# EasyEDA Pro project 25集创赛海云捷讯杯.epro, schematic Schematic4_2
Board Name: 遥控板; Create Date: 2025-04-06; Page Name: P1; Project Name: 25集创赛海云捷讯杯; Schematic Name: Schematic4_2; Update Date: 2025-04-15; Company: 嘉立创EDA; Page Size: A4; Version: V1.0
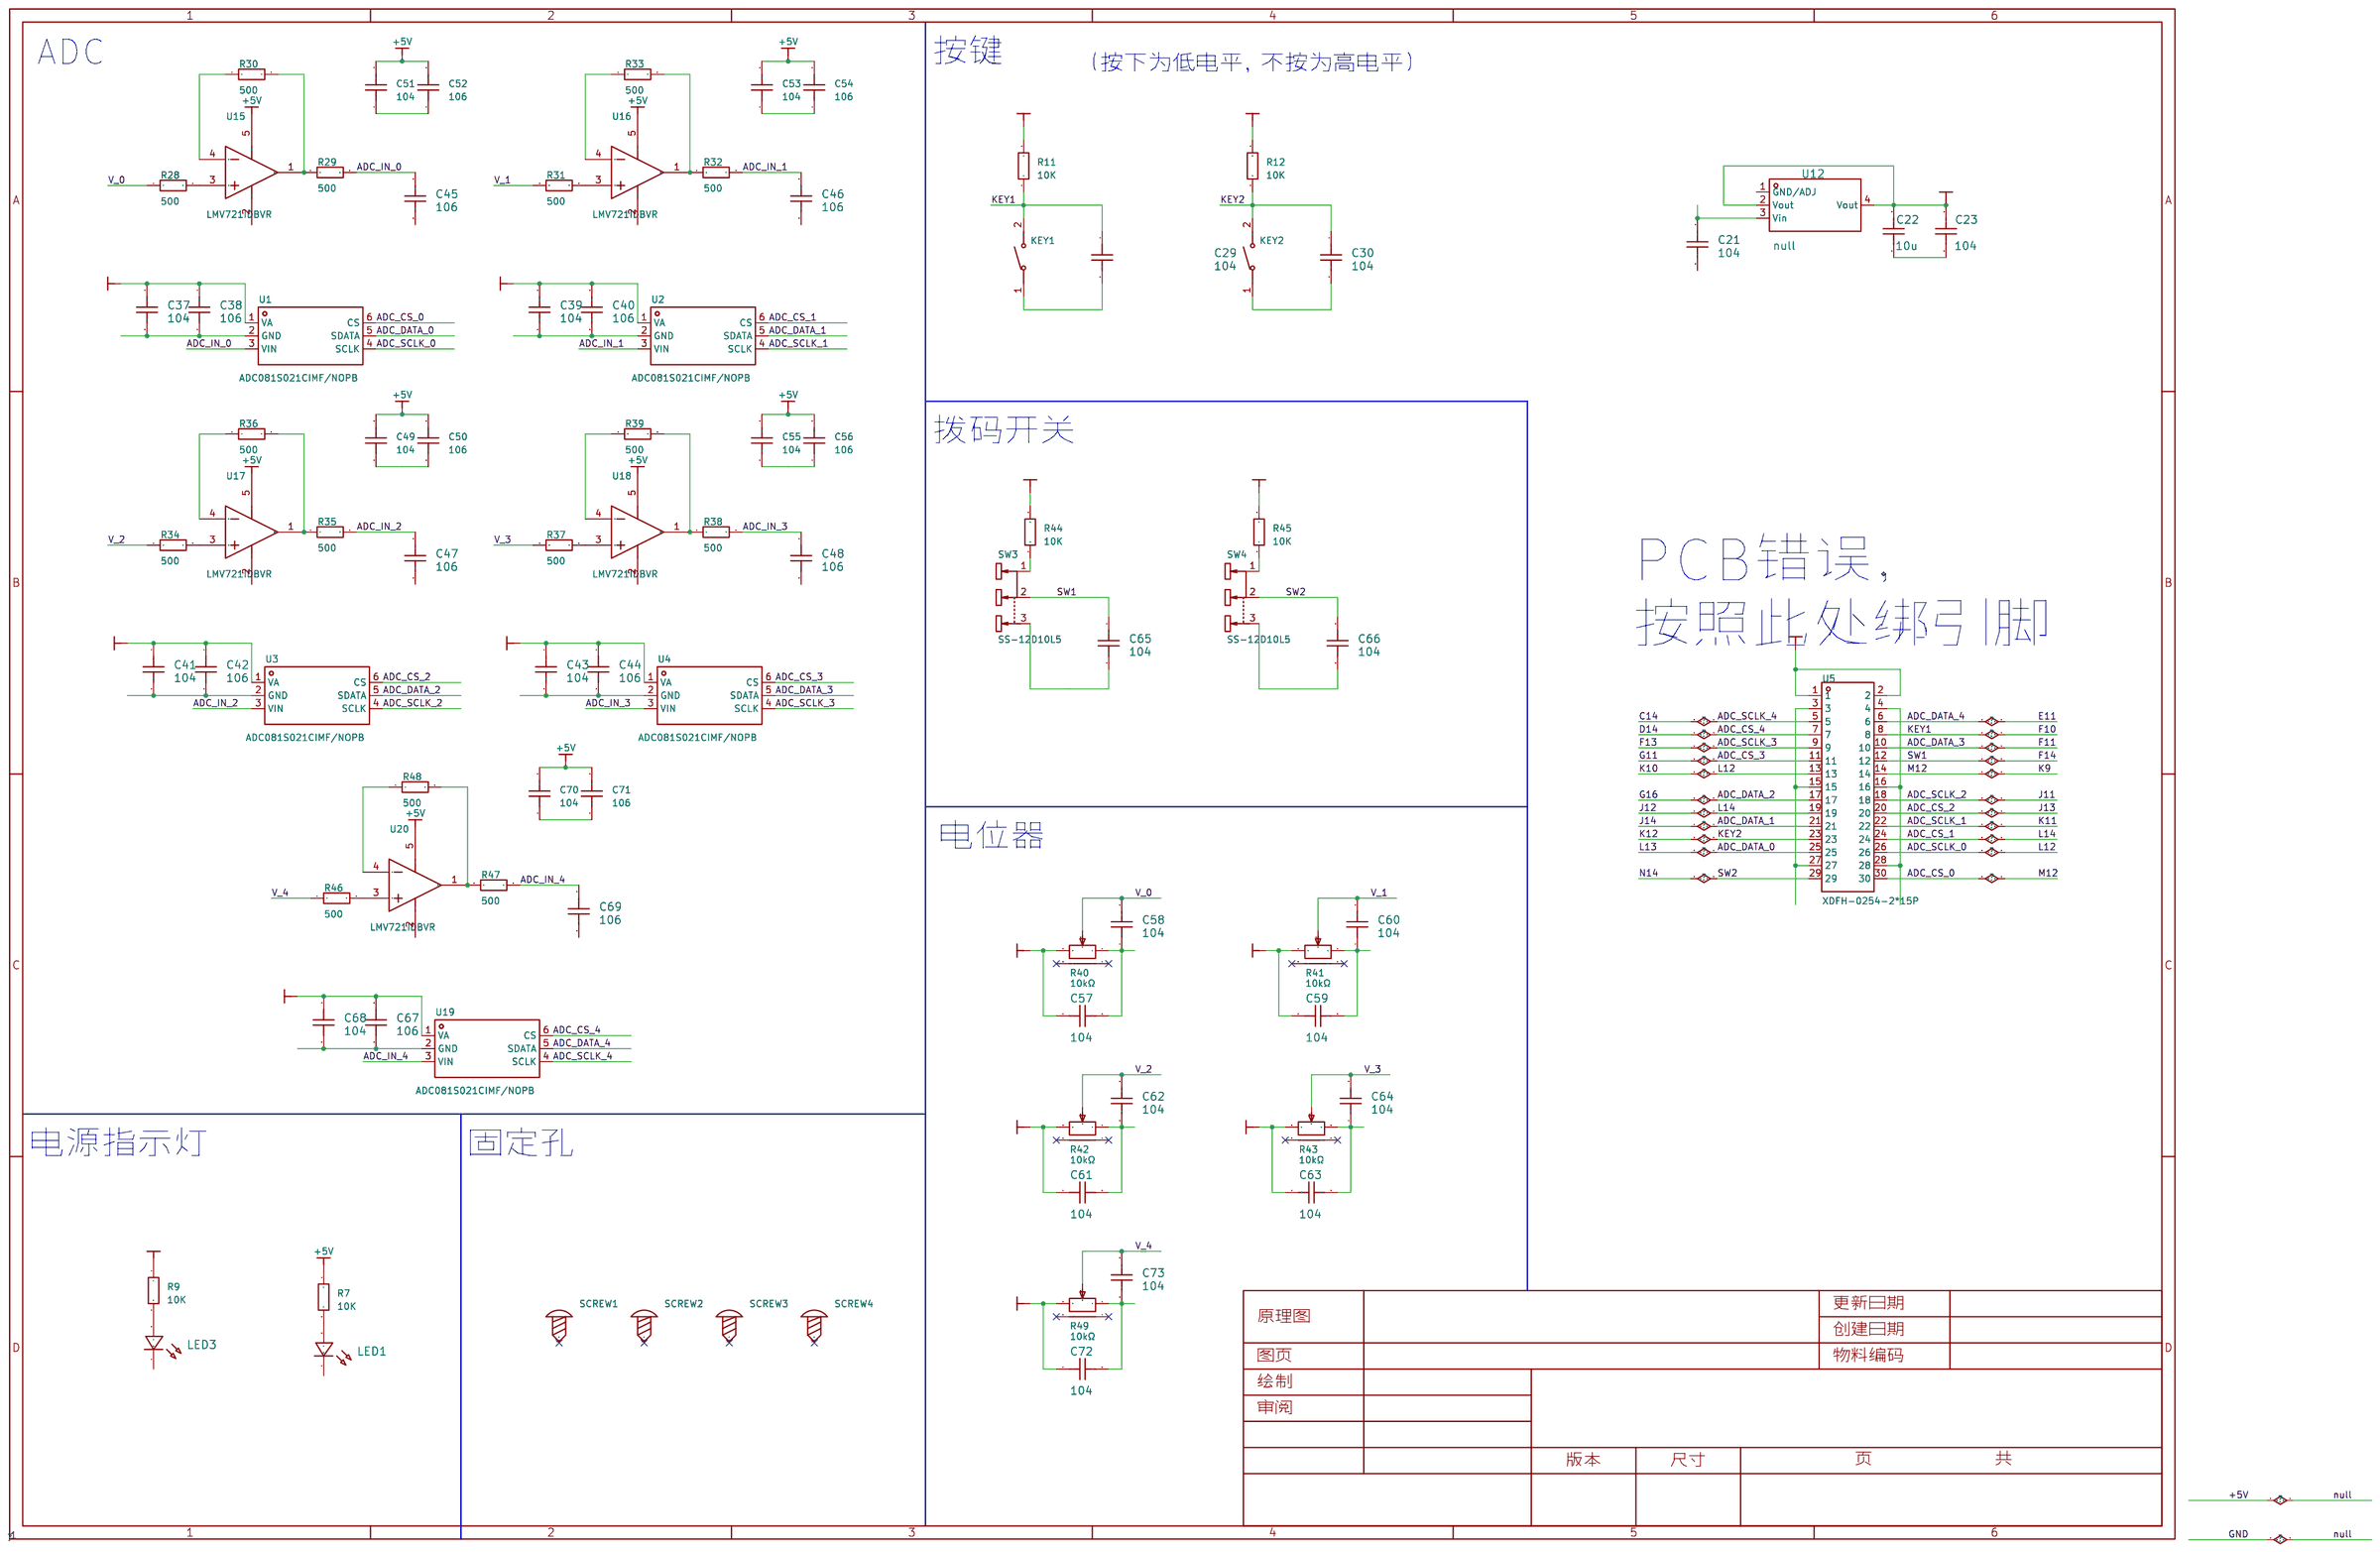
[diagram p5: schematic sheet]

## Parts
C21  104  [c0805]
C22  10u  [c0805]
C23  104  [c0805]
C29  104  [c0805]
C30  104  [c0805]
C37  104  [c0805]
C38  106  [c0805]
C39  104  [c0805]
C40  106  [c0805]
C41  104  [c0805]
C42  106  [c0805]
C43  104  [c0805]
C44  106  [c0805]
C45  106  [c0805]
C46  106  [c0805]
C47  106  [c0805]
C48  106  [c0805]
C49  104  [C0805]
C50  106  [C0805]
C51  104  [C0805]
C52  106  [C0805]
C53  104  [C0805]
C54  106  [C0805]
C55  104  [C0805]
C56  106  [C0805]
C57  104  [c0805]
C58  104  [c0805]
C59  104  [c0805]
C60  104  [c0805]
C61  104  [c0805]
C62  104  [c0805]
C63  104  [c0805]
C64  104  [c0805]
C65  104  [c0805]
C66  104  [c0805]
C67  106  [c0805]
C68  104  [c0805]
C69  106  [c0805]
C70  104  [C0805]
C71  106  [C0805]
C72  104  [c0805]
C73  104  [c0805]
KEY1  TS665WS 250gf  [SW-SMD_L6.0-W6.0-LS6.6]
KEY2  TS665WS 250gf  [SW-SMD_L6.0-W6.0-LS6.6]
LED1  -  [LED_0805]
LED3  -  [LED_0805]
R7  10K  [R0805]
R9  10K  [R0805]
R11  10K  [R0805]
R12  10K  [R0805]
R28  500  [R0805]
R29  500  [R0805]
R30  500  [R0805]
R31  500  [R0805]
R32  500  [R0805]
R33  500  [R0805]
R34  500  [R0805]
R35  500  [R0805]
R36  500  [R0805]
R37  500  [R0805]
R38  500  [R0805]
R39  500  [R0805]
R40  10kΩ  [RES-ADJ-TH_RK09K1130AJ3]
R41  10kΩ  [RES-ADJ-TH_RK09K1130AJ3]
R42  10kΩ  [RES-ADJ-TH_RK09K1130AJ3]
R43  10kΩ  [RES-ADJ-TH_RK09K1130AJ3]
R44  10K  [R0805]
R45  10K  [R0805]
R46  500  [R0805]
R47  500  [R0805]
R48  500  [R0805]
R49  10kΩ  [RES-ADJ-TH_RK09K1130AJ3]
SCREW1  -  [M3螺丝]
SCREW2  -  [M3螺丝]
SCREW3  -  [M3螺丝]
SCREW4  -  [M3螺丝]
SW3  SS-12D10L5  [SW-TH_SS-12D10L5]
SW4  SS-12D10L5  [SW-TH_SS-12D10L5]
U1  ADC081S021CIMF/NOPB  [SOT-23-6_L2.9-W1.6-P0.95-LS2.8-BR]
U2  ADC081S021CIMF/NOPB  [SOT-23-6_L2.9-W1.6-P0.95-LS2.8-BR]
U3  ADC081S021CIMF/NOPB  [SOT-23-6_L2.9-W1.6-P0.95-LS2.8-BR]
U4  ADC081S021CIMF/NOPB  [SOT-23-6_L2.9-W1.6-P0.95-LS2.8-BR]
U5  XDFH-0254-2*15P  [CONN-TH_30P-P2.54_LX_XDFH-0254-2X15P]
U12  null  [ams1117]
U15  LMV721IDBVR  [SOT-23-5_L3.0-W1.7-P0.95-LS2.8-BR]
U16  LMV721IDBVR  [SOT-23-5_L3.0-W1.7-P0.95-LS2.8-BR]
U17  LMV721IDBVR  [SOT-23-5_L3.0-W1.7-P0.95-LS2.8-BR]
U18  LMV721IDBVR  [SOT-23-5_L3.0-W1.7-P0.95-LS2.8-BR]
U19  ADC081S021CIMF/NOPB  [SOT-23-6_L2.9-W1.6-P0.95-LS2.8-BR]
U20  LMV721IDBVR  [SOT-23-5_L3.0-W1.7-P0.95-LS2.8-BR]

## Library data of the parts
C21 C23 C29 C30 C37-C48 C57-C69 C72 C73 = 4.7u
C22 = 1u
C49-C56 C70 C71 = CAP_0805: Supplier Footprint: 0805
KEY1 KEY2 = TS665WS 250gf: 电路结构:单刀单掷;按钮形状:圆形按钮;开关长度:6mm;开关宽度:6mm;开关高度:5mm;带支架:不带;触点电流:50mA;额定电压(DC):12V;额定功率:0.6W;安装方式:立贴;绝缘电阻:100MΩ;带灯:无;作用力:250gf;机械寿命:10万次;; LCSC Part Name: 无声按键开关 6*6*5mm 250G; Supplier Part: C6798384; Manufacturer: SHOU HAN(首韩); Supplier Footprint: SMD; JLCPCB Part Class: Extended Part; Datasheet: https://atta.szlcsc.com/upload/public/pdf/source/20230621/9BA9DAAFF61506696103CF7691F2BF59.pdf; Supplier: LCSC; Circuit: 单刀单掷; Actuator Style: 圆形按钮; Switch Length: 6mm; Switch Width: 6mm; Switch Height: 5mm; Strike Gundam: 不带; Contact Current: 50mA; Voltage Rating (DC): 12V; Power Rating: 0.6W; Mounting Style: 立贴; Insulation Resistance: 100MΩ; Actuator/Cap Color: 黑色; With Lamp: 无; Operating Force: 250gf; Mechanical Life: 10万次; Operating Temperature: -40℃~+80℃
LED1 LED3 = LED_0805-R: Supplier Footprint: 0805
R7 R9 R11 R12 R28-R39 R44-R48 = Res_0805: Supplier Footprint: 0805
R40-R43 R49 = RK09K1130AP5: 阻值:10kΩ;精度:±20%;功率:50mW;; LCSC Part Name: 10kΩ ±20%; Supplier Part: C470295; Manufacturer: ALPSALPINE(阿尔卑斯阿尔派); Supplier Footprint: 插件; JLCPCB Part Class: Extended Part; Datasheet: https://atta.szlcsc.com/upload/public/pdf/source/20191216/C470452_A95F493F84F2A4E5D2456A617FF6269D.pdf; Supplier: LCSC; Tolerance: ±20%; Rated Voltage: 20V; Power(Watts): 50mW
SCREW1-SCREW4 = M3螺丝: Supplier Footprint: 插件
SW3 SW4 = SS-12D10L5: 电路结构:单刀双掷;安装方式:直插;开关颜色:黑色;额定电流(DC):3A;额定电压(DC):125V;额定电流(AC):3A;额定电压(AC):125V;机械寿命:1万次;; LCSC Part Name: 柄长5mm 直插双档 滑动开关; Supplier Part: C319012; Manufacturer: XKB Connectivity(中国星坤); Supplier Footprint: 插件; JLCPCB Part Class: Extended Part; Datasheet: https://atta.szlcsc.com/upload/public/pdf/source/20211009/D6412F37AABE6F9459A6EE7FA4DAEADB.pdf; Supplier: LCSC; Circuit: 单刀双掷; Actuator Style: 矩形柱状; Pin Style: PC引脚; Switch Length: 13mm; Switch Width: 6.8mm; Switch Height: 6.4mm; Mounting Style: 直插; Actuator Color: 黑色; Current Rating (DC): 3A; Voltage Rating (DC): 125V; Current Rating (AC): 3A; Voltage Rating (AC): 125V; Mechanical Life: 1万次; Operating Temperature: -40℃~+85℃
U1-U4 U19 = ADC081S021CIMF/NOPB: 接口:SPI；DSP;电源电压:2.7V~5.25V;采样率:200kHz;分辨率:8位;; Supplier Part: C130227; Manufacturer: TI(德州仪器); Supplier Footprint: SOT-23-6; JLCPCB Part Class: 扩展库; Datasheet: https://www.ti.com/cn/lit/gpn/adc081s021; Supplier: LCSC; Interface: SPI；DSP; number of channels: 1; Supply Voltage: 2.7V~5.25V; sampling frequency: 200kHz; resolution: 8位; Operating Temperature: -40℃~+85℃
U5 = XDFH-0254-2*15P: 连接器类型:简牛座;间距:2.54mm;结构:2x15P;额定电流:3A;额定电压:500V;封装形式:直插;排数:2;每排PIN数:15;触头材质:铜;触头镀层:金;工作温度范围:-45℃~+105℃;焊接温度(最大值):260℃;; LCSC Part Name: 镀2U全金品质简牛插座PH2.54MM-2*15PIN直插板 DIP; Supplier Part: C19193814; Manufacturer: LX(连欣科技); Supplier Footprint: 插件,P=2.54mm; JLCPCB Part Class: 扩展库; Datasheet: https://atta.szlcsc.com/upload/public/pdf/source/20231117/B05B179C28F8598ADEE3EE3DBCADEC41.pdf; Supplier: LCSC; Connector Type: 简牛座; Pitch: 2.54mm; Structure: 2x15P; Current Rating (Max): 3A; Voltage Rating (Max): 500V; Holder Type: 直插; Number of Rows: 2; Pin Number in each Row: 15; Contact Material: 铜; Contact Plating: 金; Operating Temperature Range: -45℃~+105℃; Soldering Temperature(Max): 260℃
U12 = AMS1117-3.3: Supplier: LCSC; Manufacturer: AMS; Supplier Part: C6186; JLCPCB Part Class: BasicPart
U15-U18 U20 = LMV721IDBVR: 放大器数:单路;增益带宽积(GBP):10MHz;输入偏置电流(Ib):260nA;压摆率(SR):5.25V/us;带宽(-3db):-;轨到轨:-;; Supplier Part: C96137; Manufacturer: TI(德州仪器); Supplier Footprint: SOT-23-5; JLCPCB Part Class: 扩展库; Datasheet: https://www.ti.com/cn/lit/gpn/lmv721; Supplier: LCSC; Number of Circuits: 单路; Gain Bandwidth Product(GBP): 10MHz; Current - Input Bias(Ib): 260nA; Slew Rate(SR): 5.25V/us; Operating Temperature: -40℃~+105℃

## Nets
+3.3V: C22.2 C23.2 C37.1 C38.1 C39.1 C40.1 C41.1 C42.1 C43.1 C44.1 C57.1 C59.1 C61.1 C63.1 C67.1 C68.1 C72.1 R9.1 R11.2 R12.2 R40.3 R41.3 R42.3 R43.3 R44.2 R45.2 R49.3 U1.1(VA) U2.1(VA) U3.1(VA) U4.1(VA) U12.2(Vout) U12.4(Vout) U19.1(VA)
+5V: C21.1 C21.2 C22.1 C23.1 C29.2 C30.2 C37.2 C38.2 C39.2 C40.2 C41.2 C42.2 C43.2 C44.2 C45.2 C46.2 C47.2 C48.2 C49.1 C49.2 C50.1 C50.2 C51.1 C51.2 C52.1 C52.2 C53.1 C53.2 C54.1 C54.2 C55.1 C55.2 C56.1 C56.2 C57.2 C58.1 C59.2 C60.1 C61.2 C62.1 C63.2 C64.1 C65.2 C66.2 C67.2 C68.2 C69.2 C70.1 C70.2 C71.1 C71.2 C72.2 C73.1 KEY1.1(A) KEY2.1(A) LED1.1(C) LED3.1(C) R7.1 R40.1 R41.1 R42.1 R43.1 R49.1 SW3.3 SW4.3 U1.2(GND) U2.2(GND) U3.2(GND) U4.2(GND) U5.1 U5.2 U5.3 U5.4 U5.15 U5.16 U5.27 U5.28 U12.1(GND/ADJ) U12.3(Vin) U15.2(VCC-) U15.5(VCC+) U16.2(VCC-) U16.5(VCC+) U17.2(VCC-) U17.5(VCC+) U18.2(VCC-) U18.5(VCC+) U19.2(GND) U20.2(VCC-) U20.5(VCC+)
ADC_CS_0: U1.6(CS) U5.14 U5.30
ADC_CS_1: U2.6(CS) U5.19 U5.24
ADC_CS_2: U3.6(CS) U5.20
ADC_CS_3: U4.6(CS) U5.11
ADC_CS_4: U5.7 U19.6(CS)
ADC_DATA_0: U1.5(SDATA) U5.25
ADC_DATA_1: U2.5(SDATA) U5.21
ADC_DATA_2: U3.5(SDATA) U5.17
ADC_DATA_3: U4.5(SDATA) U5.10
ADC_DATA_4: U5.6 U19.5(SDATA)
ADC_IN_0: C45.1 R29.2 U1.3(VIN)
ADC_IN_1: C46.1 R32.2 U2.3(VIN)
ADC_IN_2: C47.1 R35.2 U3.3(VIN)
ADC_IN_3: C48.1 R38.2 U4.3(VIN)
ADC_IN_4: C69.1 R47.2 U19.3(VIN)
ADC_SCLK_0: U1.4(SCLK) U5.13 U5.26
ADC_SCLK_1: U2.4(SCLK) U5.22
ADC_SCLK_2: U3.4(SCLK) U5.18
ADC_SCLK_3: U4.4(SCLK) U5.9
ADC_SCLK_4: U5.5 U19.4(SCLK)
F10: C29.1 KEY1.2(B) R11.1 U5.8
F14: C65.1 SW3.2 U5.12
K12: C30.1 KEY2.2(B) R12.1 U5.23
N14: C66.1 SW4.2 U5.29
V_0: C58.2 R28.1 R40.2
V_1: C60.2 R31.1 R41.2
V_2: C62.2 R34.1 R42.2
V_3: C64.2 R37.1 R43.2
V_4: C73.2 R46.1 R49.2
$1N940: LED3.2(A) R9.2
$1N1188: R28.2 U15.3(IN+)
$1N1191: R30.1 U15.4(IN-)
$1N1192: R29.1 R30.2 U15.1(OUT)
$1N1376: R31.2 U16.3(IN+)
$1N1379: R33.1 U16.4(IN-)
$1N1380: R32.1 R33.2 U16.1(OUT)
$1N2110: R34.2 U17.3(IN+)
$1N2113: R36.1 U17.4(IN-)
$1N2114: R35.1 R36.2 U17.1(OUT)
$1N2120: R37.2 U18.3(IN+)
$1N2123: R39.1 U18.4(IN-)
$1N2124: R38.1 R39.2 U18.1(OUT)
$1N2571: LED1.2(A) R7.2
$1N6932: R44.1 SW3.1
$1N6937: R45.1 SW4.1
$1N11409: R46.2 U20.3(IN+)
$1N11412: R47.1 R48.2 U20.1(OUT)
$1N11414: R48.1 U20.4(IN-)

Not connected (* = marked no-connect by the designer): R40 4* 5*; R41 4* 5*; R42 4* 5*; R43 4* 5*; R49 4* 5*; SCREW1 1*; SCREW2 1*; SCREW3 1*; SCREW4 1*

## Notes on the sheet
- ADC
- 按键
- （按下为低电平，不按为高电平）
- 拨码开关
- PCB错误，
  按照此处绑引脚
- 电位器
- 电源指示灯
- 固定孔
